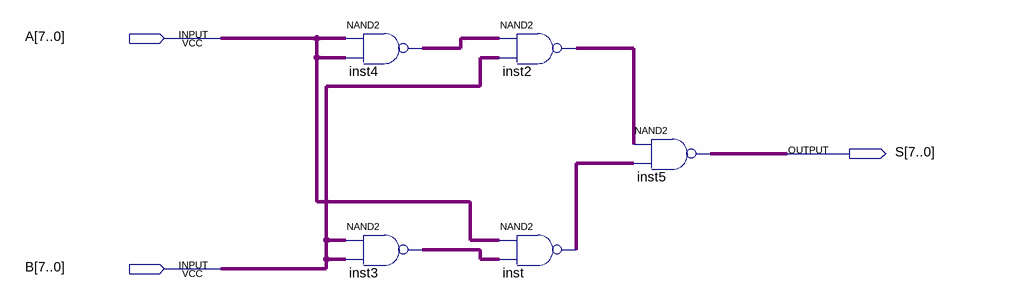
[diagram p0: schematic sheet]
// Quartus schematic TRUE_ADD.bdf as structural Verilog: 5 symbols, 3 pins
module TRUE_ADD (
  input  [7:0] A,
  input  [7:0] B,
  output [7:0] S
);

  wire [7:0] inst2_out, inst3_out, inst4_out, inst_out;

  assign inst4_out = ~(A & A);  // NAND2 inst4, 8 bits wide
  assign inst3_out = ~(B & B);  // NAND2 inst3, 8 bits wide
  assign inst2_out = ~(inst4_out & B);  // NAND2 inst2, 8 bits wide
  assign inst_out = ~(A & inst3_out);  // NAND2 inst, 8 bits wide
  assign S = ~(inst2_out & inst_out);  // NAND2 inst5, 8 bits wide
endmodule
